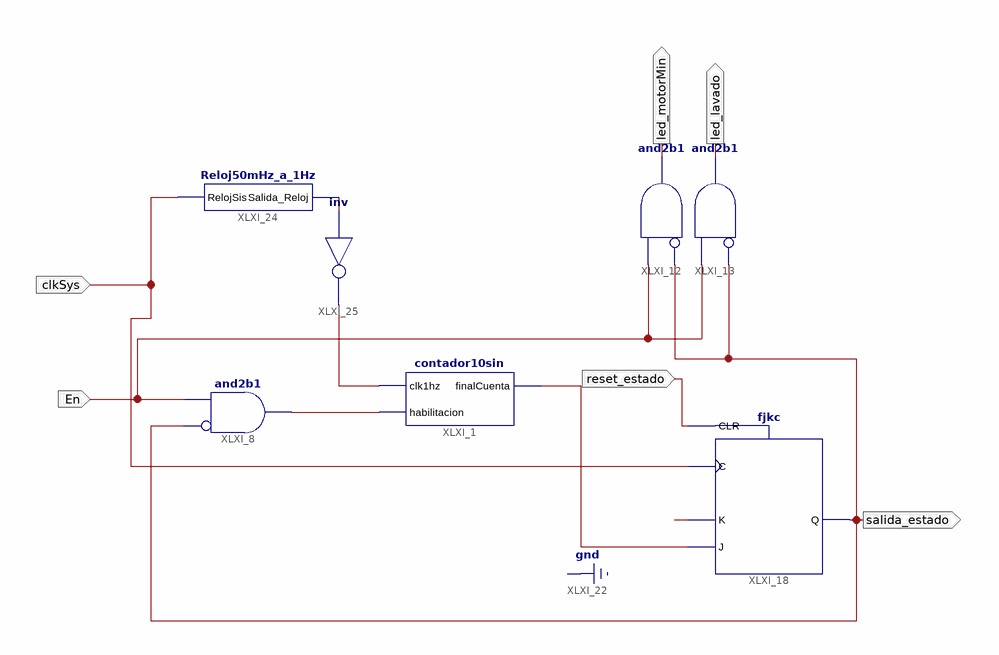
[diagram p0: schematic sheet 1]
// Xilinx ISE schematic lavado.sch (spartan3e) as structural Verilog: 7 symbols, 6 ports
module lavado (
  input  reset_estado,
  input  En,
  input  clkSys,
  output led_motorMin,
  output led_lavado,
  output salida_estado
);

  wire salidareloj1hz, XLXN_8, XLXN_47, XLXN_49;

  contador10sin XLXI_1 (.clk1hz(salidareloj1hz), .habilitacion(XLXN_8), .finalCuenta(XLXN_47));
  and XLXI_8 (XLXN_8, ~salida_estado, En);  // and2b1
  and XLXI_12 (led_motorMin, ~salida_estado, En);  // and2b1
  and XLXI_13 (led_lavado, ~salida_estado, En);  // and2b1
  fjkc XLXI_18 (.C(clkSys), .CLR(reset_estado), .J(XLXN_47), .K(1'b0), .Q(salida_estado));
  Reloj50mHz_a_1Hz XLXI_24 (.RelojSis(clkSys), .Salida_Reloj(XLXN_49));
  not XLXI_25 (salidareloj1hz, XLXN_49);
endmodule
